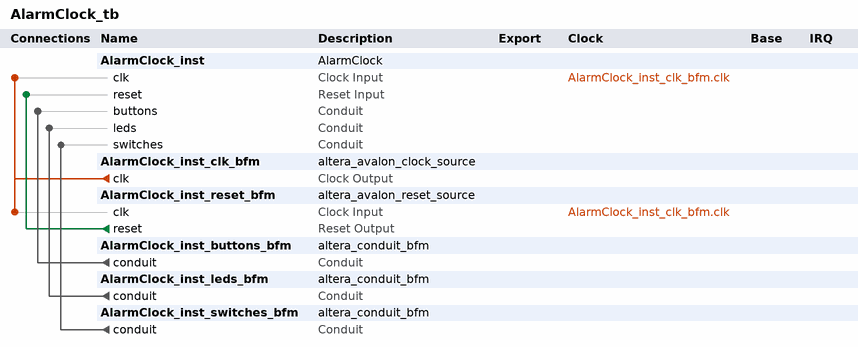
[diagram p0: system contents]
# Platform Designer (Qsys) system AlarmClock_tb, Cyclone V 5CSEMA5F31C6
# Parameters at their usual value, and those the tool derives, are not listed.
package require -exact qsys 18.1
create_system AlarmClock_tb
set_project_property DEVICE_FAMILY {Cyclone V}
set_project_property DEVICE 5CSEMA5F31C6

add_instance AlarmClock_inst AlarmClock 1.0

add_instance AlarmClock_inst_clk_bfm altera_avalon_clock_source 18.1

add_instance AlarmClock_inst_reset_bfm altera_avalon_reset_source 18.1
set_instance_parameter_value AlarmClock_inst_reset_bfm ASSERT_HIGH_RESET 0
set_instance_parameter_value AlarmClock_inst_reset_bfm INITIAL_RESET_CYCLES 50

add_instance AlarmClock_inst_buttons_bfm altera_conduit_bfm 18.1
set_instance_parameter_value AlarmClock_inst_buttons_bfm CLOCKED_SIGNAL false
set_instance_parameter_value AlarmClock_inst_buttons_bfm ENABLE_RESET false
set_instance_parameter_value AlarmClock_inst_buttons_bfm SIGNAL_DIRECTIONS output
set_instance_parameter_value AlarmClock_inst_buttons_bfm SIGNAL_WIDTHS 4

add_instance AlarmClock_inst_leds_bfm altera_conduit_bfm 18.1
set_instance_parameter_value AlarmClock_inst_leds_bfm CLOCKED_SIGNAL false
set_instance_parameter_value AlarmClock_inst_leds_bfm ENABLE_RESET false
set_instance_parameter_value AlarmClock_inst_leds_bfm SIGNAL_DIRECTIONS input
set_instance_parameter_value AlarmClock_inst_leds_bfm SIGNAL_WIDTHS 32

add_instance AlarmClock_inst_switches_bfm altera_conduit_bfm 18.1
set_instance_parameter_value AlarmClock_inst_switches_bfm CLOCKED_SIGNAL false
set_instance_parameter_value AlarmClock_inst_switches_bfm ENABLE_RESET false
set_instance_parameter_value AlarmClock_inst_switches_bfm SIGNAL_DIRECTIONS output
set_instance_parameter_value AlarmClock_inst_switches_bfm SIGNAL_WIDTHS 4

# connections
add_connection AlarmClock_inst_clk_bfm.clk AlarmClock_inst.clk clock
add_connection AlarmClock_inst_clk_bfm.clk AlarmClock_inst_reset_bfm.clk clock
add_connection AlarmClock_inst_reset_bfm.reset AlarmClock_inst.reset reset
add_connection AlarmClock_inst_buttons_bfm.conduit AlarmClock_inst.buttons conduit
add_connection AlarmClock_inst_leds_bfm.conduit AlarmClock_inst.leds conduit
add_connection AlarmClock_inst_switches_bfm.conduit AlarmClock_inst.switches conduit

set_interconnect_requirement {$system} qsys_mm.clockCrossingAdapter HANDSHAKE
set_interconnect_requirement {$system} qsys_mm.enableEccProtection FALSE
set_interconnect_requirement {$system} qsys_mm.insertDefaultSlave FALSE
set_interconnect_requirement {$system} qsys_mm.maxAdditionalLatency 1

save_system AlarmClock_tb.qsys
